# Altium schematic sheet BMU_V50_StringPWRControl.SchDoc
size C
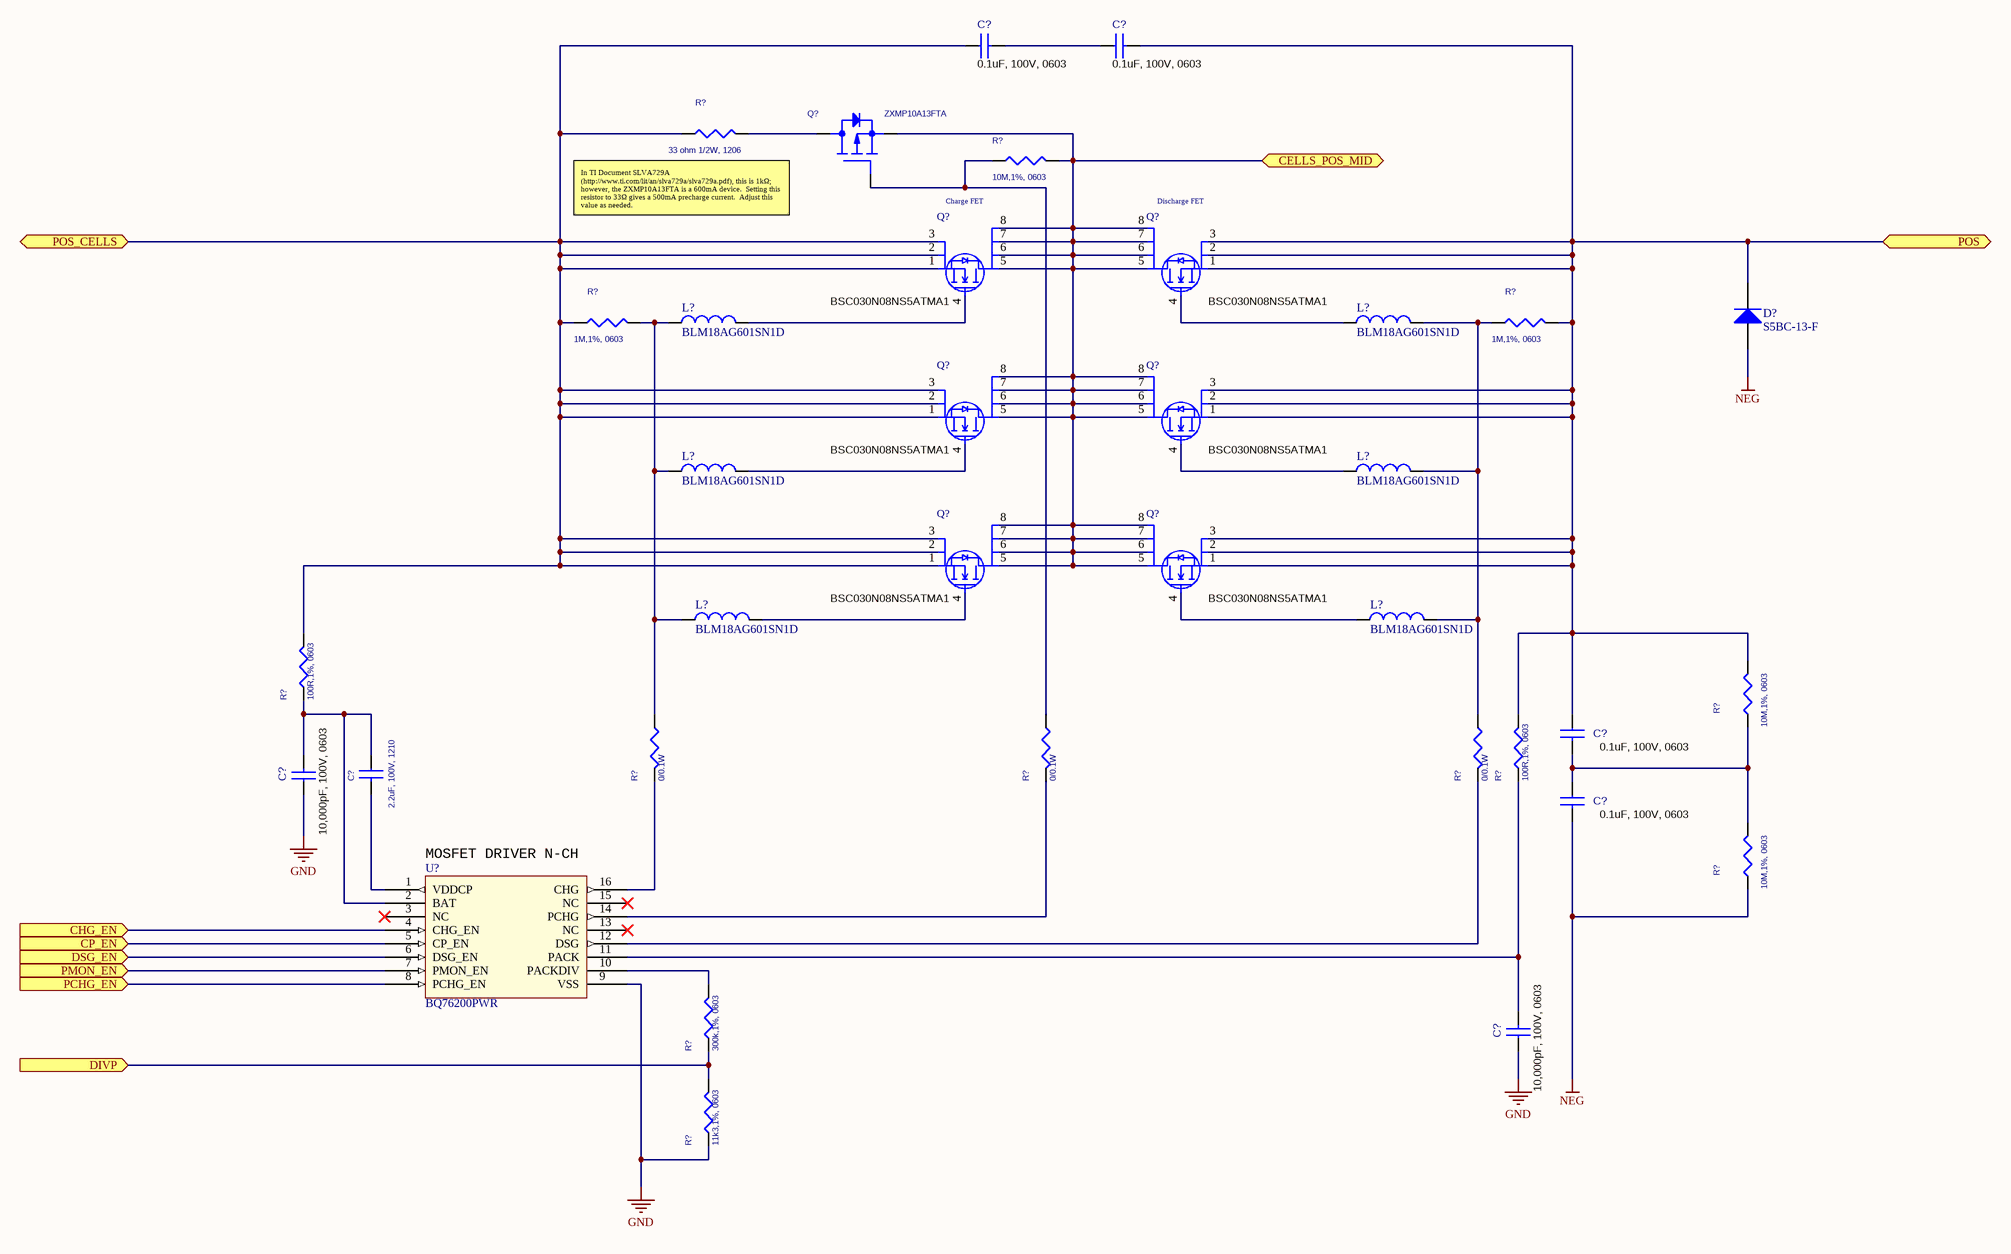
[diagram p0: BMU_V50_StringPWRControl.SchDoc]

## Parts
(Parts that share a designator on the sheet are numbered #1, #2 ... from top to bottom, then left to right.)
C?#1  0.1uF, 100V, 0603  [C0603]
C?#2  0.1uF, 100V, 0603  [C0603]
C?#3  0.1uF, 100V, 0603  [C0603]
C?#4  2.2uF, 100V, 1210  [C1210]
C?#5  10,000pF, 100V, 0603  [C0603]
C?#6  0.1uF, 100V, 0603  [C0603]
C?#7  10,000pF, 100V, 0603  [C0603]
D?  S5BC-13-F  [DIOD-S5xC_V]
L?#1  BLM18AG601SN1D  [INDC1608X10N]
L?#2  BLM18AG601SN1D  [INDC1608X10N]
L?#3  BLM18AG601SN1D  [INDC1608X10N]
L?#4  BLM18AG601SN1D  [INDC1608X10N]
L?#5  BLM18AG601SN1D  [INDC1608X10N]
L?#6  BLM18AG601SN1D  [INDC1608X10N]
Q?#1  ZXMP10A13FTA  [SOT-23]
Q?#2  BSC030N08NS5ATMA1  [8TDSON]
Q?#3  BSC030N08NS5ATMA1  [8TDSON]
Q?#4  BSC030N08NS5ATMA1  [8TDSON]
Q?#5  BSC030N08NS5ATMA1  [8TDSON]
Q?#6  BSC030N08NS5ATMA1  [8TDSON]
Q?#7  BSC030N08NS5ATMA1  [8TDSON]
R?#1  33 ohm 1/2W, 1206  [R1206]
R?#2  10M,1%, 0603  [R0603]
R?#3  1M,1%, 0603  [R0603]
R?#4  1M,1%, 0603  [R0603]
R?#5  100R,1%, 0603  [R0603]
R?#6  10M,1%, 0603  [R0603]
R?#7  0/0.1W  [R0603]
R?#8  0/0.1W  [R0603]
R?#9  0/0.1W  [R0603]
R?#10  100R,1%, 0603  [R0603]
R?#11  10M,1%, 0603  [R0603]
R?#12  300k,1%, 0603  [R0603]
R?#13  11k3,1%, 0603  [R0603]
U?  BQ76200PWR  [PW16]

## Ports
CELLS_POS_MID (bidir), CHG_EN (in), CP_EN (in), DIVP (in), DSG_EN (in), PCHG_EN (in), PMON_EN (in), POS (bidir), POS_CELLS (bidir)

## Nets
GND: C?#5.1 C?#7.1 R?#13.1 U?.9(VSS)
NEG: C?#6.2 D?.1(A) R?#11.1
CELLS_POS_MID: Q?#1.S Q?#2.5(D1) Q?#2.6(D2) Q?#2.7(D3) Q?#2.8(D4) Q?#3.5(D1) Q?#3.6(D2) Q?#3.7(D3) Q?#3.8(D4) Q?#4.5(D1) Q?#4.6(D2) Q?#4.7(D3) Q?#4.8(D4) Q?#5.5(D1) Q?#5.6(D2) Q?#5.7(D3) Q?#5.8(D4) Q?#6.5(D1) Q?#6.6(D2) Q?#6.7(D3) Q?#6.8(D4) Q?#7.5(D1) Q?#7.6(D2) Q?#7.7(D3) Q?#7.8(D4) R?#2.2 ; port CELLS_POS_MID
CHG_EN: U?.4(CHG_EN) ; port CHG_EN
CP_EN: U?.5(CP_EN) ; port CP_EN
DIVP: R?#12.1 R?#13.2 ; port DIVP
DSG_EN: U?.6(DSG_EN) ; port DSG_EN
PCHG_EN: U?.8(PCHG_EN) ; port PCHG_EN
PMON_EN: U?.7(PMON_EN) ; port PMON_EN
POS: C?#2.2 C?#3.1 D?.2(K) Q?#3.1(S1) Q?#3.2(S2) Q?#3.3(S3) Q?#5.1(S1) Q?#5.2(S2) Q?#5.3(S3) Q?#7.1(S1) Q?#7.2(S2) Q?#7.3(S3) R?#4.2 R?#6.2 R?#10.2 ; port POS
POS_CELLS: C?#1.1 Q?#2.1(S1) Q?#2.2(S2) Q?#2.3(S3) Q?#4.1(S1) Q?#4.2(S2) Q?#4.3(S3) Q?#6.1(S1) Q?#6.2(S2) Q?#6.3(S3) R?#1.1 R?#3.1 R?#5.2 ; port POS_CELLS
NetC?#1_2: C?#1.2 C?#2.1
NetC?#3_2: C?#3.2 C?#6.1 R?#6.1 R?#11.2
NetC?#4_1: C?#4.1 C?#5.2 R?#5.1 U?.2(BAT)
NetC?#4_2: C?#4.2 U?.1(VDDCP)
NetC?#7_2: C?#7.2 R?#10.1 U?.11(PACK)
NetL?#1_1: L?#1.1 L?#3.1 L?#5.1 R?#3.2 R?#7.1
NetL?#1_2: L?#1.2 Q?#2.4(G)
NetL?#2_1: L?#2.1 Q?#3.4(G)
NetL?#2_2: L?#2.2 L?#4.2 L?#6.2 R?#4.1 R?#9.1
NetL?#3_2: L?#3.2 Q?#4.4(G)
NetL?#4_1: L?#4.1 Q?#5.4(G)
NetL?#5_2: L?#5.2 Q?#6.4(G)
NetL?#6_1: L?#6.1 Q?#7.4(G)
NetQ?#1_D: Q?#1.D R?#1.2
NetQ?#1_G: Q?#1.G R?#2.1 R?#8.1
NetR?#7_2: R?#7.2 U?.16(CHG)
NetR?#8_2: R?#8.2 U?.14(PCHG)
NetR?#9_2: R?#9.2 U?.12(DSG)
NetR?#12_2: R?#12.2 U?.10(PACKDIV)

Not connected (* = marked no-connect by the designer): U? 3(NC)* 13(NC)* 15(NC)*

## Notes on the sheet
- (near Q?#2) Charge FET
- (near Q?#3) Discharge FET
- In TI Document SLVA729A (http://www.ti.com/lit/an/slva729a/slva729a.pdf), this is 1kΩ; however, the ZXMP10A13FTA is a 600mA device.  Setting this resistor to 33Ω gives a 500mA precharge current.  Adjust this value as needed.
- (near U?) MOSFET DRIVER N-CH
- Title
- MATTERNET
- PROPRIETRY & CONFIDENTIAL
  THE INFORMATION CONTAINS IN THIS DRAWING
  IS THE SOLE PROPERTY OF  MATTERNET Inc.
  ANY REPRODUCTION IN PART OR AS WHOLE
  WITHOUT A WRITTEN PERMISSION OF
  MATTERNET Inc. IS PROHIBITED
- Size:
- Date:
- File:
- C
- Number:
- Time:
- Revision:
- Sheet
- of
- 161 E. Evelyn Ave.
- Mountain View,
- CA 94041 USA

## Library data of the parts
C?#1-C?#3 C?#6 = CAP-Generic-0603: CAP CER 0.1UF 100V 20% X7R 0603; Manufacturer: Murata; Manufacturer Part Number: GCJ188R71E104KA12D; Supplier 1: Digi-Key; Supplier Part Number 1: 490-16477-1-ND; Stock 1: 2560; Pricing 1: 1=0.22, 10=0.152, 100=0.077, 500=0.0527, 1000=0.04662 (USD); Case/Package: 0603; Supplier 2: Mouser; Supplier Part Number 2: 81-GCJ188R71E104KA2D; Stock 2: 47905; Pricing 2: 1=0.21, 10=0.139, 50=0.139, 100=0.071, 1000=0.043, 10000=0.035 (USD)
C?#4 = CAP-Generic-1210: custinv: Ansync; custprt: 100-0200-000106; Option: AB
C?#5 C?#7 = CAP-Generic-0603: CAP CER 10000PF 50V X7R 0603; Manufacturer: TDK; Manufacturer Part Number: CGA3E2X7R1H103K080AE; Capacitance: 10nF; Tolerance: 10%; Supplier 1: Digi-Key; Supplier Part Number 1: 445-15955-1-ND; Stock 1: 42633; Pricing 1: 1=0.27, 10=0.186, 100=0.0944, 500=0.06458, 1000=0.05713 (USD); Mount: Surface Mount; Case/Package: 0603; Weight: 7.1E-05oz; Case Code (Metric): 1608; Case Code (Imperial): 0603; Min Operating Temperature: -55°C; Max Operating Temperature: 125°C; Package Quantity: 4000; Packaging: Tape and Reel; Voltage Rating: 50V; Dielectric: X7R; Termination: SMD/SMT; Voltage Rating (DC): 50V; Features: Soft Termination; Length: 0.063inch; Height: 0.8mm; Width: 0.031inch; Thickness: 0.035inch; Ratings: AEC-Q200
D? = CMP-2000-07025-1: Surface Mount Glass Passivated Rectifier, 5 A, 100 V, -65 to 150 degC, 2-Pin SMC, RoHS, Tape and Reel; Manufacturer: Diodes Inc; Reverse Current-Max: 10µA; Peak Current-Max: 100A; Average Rectified Current-Max: 5A; Reverse Voltage-Max [Vrrm]: 100V; Forward Voltage: 1.15V; Datasheet URL: http://www.diodes.com/_files/datasheets/ds16007.pdf; Package Description: 2-Pin Molded Component, Body 6.855 x 5.905 mm; Manufacturer URL: http://www.diodes.com/; Datasheet Version: Rev. 9-2, 09/2010; Package Reference: S5xC; Mounting Technology: SurfaceMount
L?#1-L?#6 = BLM18AG601SN1D: FERRITE BEAD 600 OHM 0603 1LN; ComponentLink1Description: Reference Spec; ComponentLink1URL: https://www.murata.com/en-us/products/productdata/8796738650142/ENFA0003.pdf; Supplier 1: Digi-Key; Supplier 2: Digi-Key; Supplier 3: Mouser; Supplier Part Number 1: 490-1014-1-ND; Supplier Part Number 2: 490-1014-2-ND; Supplier Part Number 3: 81-BLM11A601S
Q?#1 = FET-P-CH-Generic_OP4_0: P-Channel 100V 600mA (Ta) 625mW (Ta) Surface Mount SOT-23-3; Manufacturer 1: Diodes Zetex; custinv: Ansync; custprt: 100-0300-000087; Option: AB; Rise Time: 2.1ns; Gate to Source Voltage (Vgs): 20V; Fall Time: 3.3ns; Turn-Off Delay Time: 5.9ns; Turn-On Delay Time: 1.6ns; Rds On Max: 1R; Input Capacitance: 141pF; Number of Elements: 1; Continuous Drain Current (ID): -700mA; Drain to Source Resistance: 1.45R; Power Dissipation: 806mW; Threshold Voltage: -4V; Element Configuration: Single; Drain to Source Breakdown Voltage: -100V; Current Rating: -500mA; Supplier 1: Digi-Key; Supplier Part Number 1: ZXMP10A13FCT-ND; Manufacturer Part Number 1: ZXMP10A13FTA; Stock 1: 331879; Pricing 1: 1=0.57000, 10=0.49100, 100=0.34070, 500=0.26602, 1000=0.21622 (USD); RoHS: Yes; Mount: Surface Mount; Case/Package: SOT-23; Number of Pins: 3; Weight: 0.000282oz; Min Operating Temperature: -55°C; Max Operating Temperature: 150°C; Packaging: Tape and Reel; Package Quantity: 3000; Max Power Dissipation: 625mW; Drain to Source Voltage (Vdss): 100V; Number of Channels: 1; Voltage Rating (DC): -100V; On-State Resistance: 1R; Length: 3.04mm; Height: 1.02mm; Width: 1.4mm; Radiation Hardening: No; REACH SVHC: No SVHC; Lead Free: Lead Free; ComponentLink1URL: https://datasheet.ciiva.com/6383/zxmp10a13f-6383089.pdf?src-supplier=Digi-Key; ComponentLink1Description: https://datasheet.ciiva.com/6383/zxmp10a13f-6383089.pdf?src-supplier=Digi-Key; ComponentLink2URL: https://datasheet.ciiva.com/11175/zxmp10a13f-11175011.pdf?src-supplier=Avnet; ComponentLink2Description: https://datasheet.ciiva.com/11175/zxmp10a13f-11175011.pdf?src-supplier=Avnet; ComponentLink3URL: https://datasheet.ciiva.com/17097/zxmp10a13fta-17097946.pdf?src-supplier=Allied+Electronics; ComponentLink3Description: https://datasheet.ciiva.com/17097/zxmp10a13fta-17097946.pdf?src-supplier=Allied+Electronics; ComponentLink4URL: https://datasheet.ciiva.com/22712/1915646-22712428.pdf?src-supplier=Element14; ComponentLink4Description: https://datasheet.ciiva.com/22712/1915646-22712428.pdf?src-supplier=Element14; ComponentLink5URL: https://datasheet.ciiva.com/16387/zxmp10a13f-16387581.pdf?src-supplier=Future+Electronics; ComponentLink5Description: https://datasheet.ciiva.com/16387/zxmp10a13f-16387581.pdf?src-supplier=Future+Electronics; ComponentLink6URL: https://datasheet.ciiva.com/6383/zxmp10a13f-6383087.pdf?src-supplier=Digi-Key; ComponentLink6Description: https://datasheet.ciiva.com/6383/zxmp10a13f-6383087.pdf?src-supplier=Digi-Key
Q?#2-Q?#7 = BSC030N08NS5ATMA1: MOSFET N-CH 80V 100A 8TDSON; Manufacturer: Infineon; Rds On Max: 3mR; Input Capacitance: 5.6nF; Max Power Dissipation: 2.5W; Gate to Source Voltage (Vgs): 20V; Turn-On Delay Time: 20ns; Rise Time: 12ns; Turn-Off Delay Time: 43ns; Fall Time: 13ns; Element Configuration: Single; Number of Channels: 1; Drain to Source Resistance: 4.5mR; Supplier 1: Digi-Key; Supplier Part Number 1: BSC030N08NS5ATMA1CT-ND; Manufacturer Part Number: BSC030N08NS5ATMA1; Stock 1: 0; Pricing 1: 1=2.41, 10=2.181, 100=1.7526, 500=1.36316, 1000=1.12947 (USD); Mount: Surface Mount; Number of Pins: 8; Weight: 0.01787oz; Min Operating Temperature: -55°C; Max Operating Temperature: 150°C; Packaging: Tape and Reel; Drain to Source Voltage (Vdss): 80V; Continuous Drain Current (ID): 100A; Drain to Source Breakdown Voltage: 80V; Package Quantity: 5000; Max Dual Supply Voltage: 80V; Lead Free: Contains Lead; Halogen Free: Halogen Free; Supplier 2: Mouser; Supplier Part Number 2: 726-BSC030N08NS5ATMA; Stock 2: 0; Pricing 2: 1=2.03, 10=1.72, 50=1.72, 100=1.38, 1000=0.997, 10000=0.894 (USD); Supplier 3: Newark; Supplier Part Number 3: 12AC9442; Stock 3: 3452; Pricing 3: 1=2.03, 10=1.72, 25=1.61, 50=1.49, 100=1.38, 250=1.3, 500=1.21, 1000=0.997 (USD)
R?#1 = R-Generic-1206: custinv: Ansync; custprt: 100-0100-000238; Option: AB
R?#2-R?#6 R?#10-R?#13 = R-Generic-0603: custprt: 100-0110-000153; custinv: Ansync; Option: AB
R?#7-R?#9 = R-Generic-0402: custinv: Ansync; custprt: 100-0120-000002; Option: N
U? = bq76200: High-voltage battery pack front-end charge/discharge high-side NFET driver; ComponentLink1Description: Datasheet; ComponentLink1URL: http://www.ti.com/lit/ds/symlink/bq76200.pdf; Supplier 1: Digi-Key; Supplier 2: Arrow; Supplier 3: Mouser; Supplier Part Number 1: 296-43273-1-ND; Supplier Part Number 2: BQ76200PWR; Supplier Part Number 3: 595-BQ76200PWR